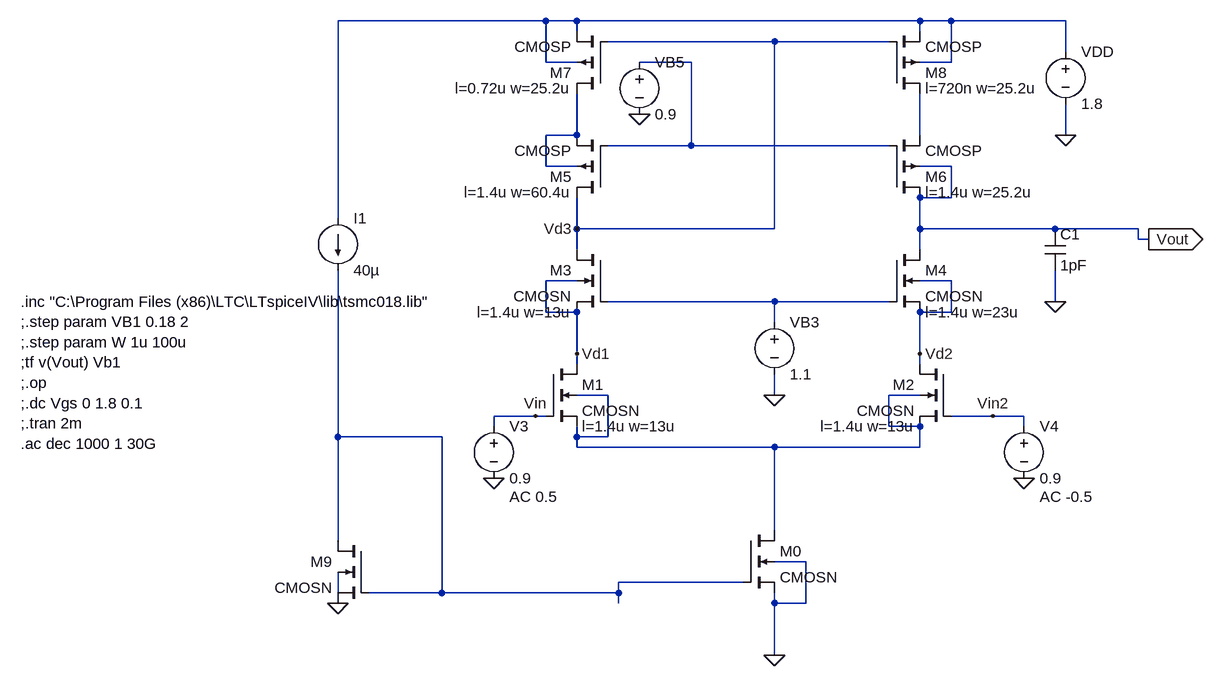
[diagram p0: schematic telescopic2.asc]
telescopic2.asc, the LTspice schematic file:
Version 4
SHEET 1 888 680
WIRE -160 -384 -480 -384
WIRE -112 -384 -160 -384
WIRE 416 -384 -112 -384
WIRE 464 -384 416 -384
WIRE 640 -384 464 -384
WIRE -112 -368 -112 -384
WIRE 416 -368 416 -384
WIRE 192 -352 -64 -352
WIRE 368 -352 192 -352
WIRE 640 -336 640 -384
WIRE -160 -320 -160 -384
WIRE -112 -320 -160 -320
WIRE 64 -320 -16 -320
WIRE 464 -320 464 -384
WIRE 464 -320 416 -320
WIRE -112 -208 -112 -272
WIRE -112 -208 -160 -208
WIRE 416 -208 416 -272
WIRE 640 -208 640 -256
WIRE 64 -192 64 -320
WIRE 64 -192 -64 -192
WIRE 368 -192 64 -192
WIRE -160 -160 -160 -208
WIRE -112 -160 -160 -160
WIRE 464 -160 416 -160
WIRE 464 -112 464 -160
WIRE 464 -112 416 -112
WIRE -480 -80 -480 -384
WIRE -112 -64 -112 -112
WIRE 192 -64 192 -352
WIRE 192 -64 -112 -64
WIRE 416 -64 416 -112
WIRE 624 -64 416 -64
WIRE 752 -64 624 -64
WIRE 752 -48 752 -64
WIRE 768 -48 752 -48
WIRE -112 -32 -112 -64
WIRE 416 -32 416 -64
WIRE -112 16 -160 16
WIRE 464 16 416 16
WIRE 192 48 -64 48
WIRE 368 48 192 48
WIRE 624 48 624 0
WIRE -160 64 -160 16
WIRE -112 64 -160 64
WIRE 464 64 464 16
WIRE 464 64 416 64
WIRE 192 80 192 48
WIRE -112 128 -112 64
WIRE 416 128 416 64
WIRE -112 144 -112 128
WIRE 416 144 416 128
WIRE -64 192 -112 192
WIRE 192 192 192 160
WIRE 416 192 368 192
WIRE -176 224 -240 224
WIRE -160 224 -176 224
WIRE 528 224 464 224
WIRE 576 224 528 224
WIRE -240 240 -240 224
WIRE 368 240 368 192
WIRE 416 240 368 240
WIRE 576 240 576 224
WIRE -480 256 -480 0
WIRE -320 256 -480 256
WIRE -112 256 -112 240
WIRE -64 256 -64 192
WIRE -64 256 -112 256
WIRE -112 272 -112 256
WIRE 192 272 -112 272
WIRE 416 272 416 240
WIRE 416 272 192 272
WIRE 192 400 192 272
WIRE -480 416 -480 256
WIRE 240 448 192 448
WIRE 144 480 -48 480
WIRE -480 496 -480 464
WIRE -320 496 -320 256
WIRE -320 496 -432 496
WIRE -48 496 -48 480
WIRE -48 496 -320 496
WIRE -48 512 -48 496
WIRE 192 512 192 496
WIRE 240 512 240 448
WIRE 240 512 192 512
WIRE 192 592 192 512
FLAG 640 -208 0
FLAG 192 592 0
FLAG 624 48 0
FLAG 192 192 0
FLAG -112 128 Vd1
FLAG 416 128 Vd2
FLAG -112 -64 Vd3
FLAG 528 224 Vin2
FLAG 768 -48 Vout
IOPIN 768 -48 Out
FLAG -16 -240 0
FLAG -240 320 0
FLAG 576 320 0
FLAG -480 512 0
FLAG -176 224 Vin
SYMBOL cmosn -160 144 R0
WINDOW 123 56 96 Left 2
SYMATTR InstName M1
SYMATTR Value2 l=1.4u w=13u
SYMBOL cmosn 368 -32 R0
WINDOW 123 56 96 Left 2
SYMATTR InstName M4
SYMATTR Value2 l=1.4u w=23u
SYMBOL cmosn -64 -32 M0
WINDOW 123 56 96 Left 2
SYMATTR InstName M3
SYMATTR Value2 l=1.4u w=13u
SYMBOL cmosn 464 144 M0
WINDOW 123 56 96 Left 2
SYMATTR InstName M2
SYMATTR Value2 l=1.4u w=13u
SYMBOL cmosn 144 400 R0
SYMATTR InstName M0
SYMATTR Value2 l=180n w=200n
SYMBOL cmosp 368 -112 M180
WINDOW 123 56 8 Left 2
SYMATTR InstName M6
SYMATTR Value2 l=1.4u w=25.2u
SYMBOL cmosp 368 -272 M180
WINDOW 123 56 8 Left 2
SYMATTR InstName M8
SYMATTR Value2 l=720n w=25.2u
SYMBOL cmosp -64 -272 R180
WINDOW 123 56 8 Left 2
SYMATTR InstName M7
SYMATTR Value2 l=0.72u w=25.2u
SYMBOL cmosp -64 -112 R180
WINDOW 123 56 8 Left 2
SYMATTR InstName M5
SYMATTR Value2 l=1.4u w=60.4u
SYMBOL voltage 640 -352 R0
WINDOW 123 0 0 Left 2
WINDOW 39 0 0 Left 2
SYMATTR InstName VDD
SYMATTR Value 1.8
SYMBOL cap 608 -64 R0
SYMATTR InstName C1
SYMATTR Value 1pF
SYMBOL voltage 192 64 R0
WINDOW 123 0 0 Left 2
WINDOW 39 0 0 Left 2
SYMATTR InstName VB3
SYMATTR Value 1.1
SYMBOL voltage -16 -336 R0
SYMATTR InstName VB5
SYMATTR Value 0.9
SYMBOL voltage -240 224 R0
WINDOW 123 24 124 Left 2
WINDOW 39 0 0 Left 2
SYMATTR Value2 AC 0.5
SYMATTR InstName V3
SYMATTR Value 0.9
SYMBOL voltage 576 224 R0
WINDOW 123 24 124 Left 2
WINDOW 39 0 0 Left 2
SYMATTR Value2 AC -0.5
SYMATTR InstName V4
SYMATTR Value 0.9
SYMBOL current -480 -80 R0
SYMATTR InstName I1
SYMATTR Value 40µ
SYMBOL cmosn -432 416 M0
SYMATTR InstName M9
SYMATTR Value2 l=180n w=360n
TEXT -968 48 Left 2 !.inc "C:\\Program Files (x86)\\LTC\\LTspiceIV\\lib\\tsmc018.lib"\n;.step param VB1 0.18 2\n;.step param W 1u 100u\n;tf v(Vout) Vb1\n;.op\n;.dc Vgs 0 1.8 0.1\n;.tran 2m\n.ac dec 1000 1 30G

The netlist it stands for:
* telescopic2.asc
M1 Vd1 Vin N006 N006 CMOSN l=1.4u w=13u
M4 Vout N005 Vd2 Vd2 CMOSN l=1.4u w=23u
M3 Vd3 N005 Vd1 Vd1 CMOSN l=1.4u w=13u
M2 Vd2 Vin2 N006 N006 CMOSN l=1.4u w=13u
M0 N006 N007 0 0 CMOSN l=180n w=200n
M6 Vout N002 N004 Vout CMOSP l=1.4u w=25.2u
M8 N004 Vd3 N001 N001 CMOSP l=720n w=25.2u
M7 N003 Vd3 N001 N001 CMOSP l=0.72u w=25.2u
M5 Vd3 N002 N003 N003 CMOSP l=1.4u w=60.4u
VDD N001 0 1.8
C1 Vout 0 1pF
VB3 N005 0 1.1
VB5 N002 0 0.9
V3 Vin 0 0.9 AC 0.5
V4 Vin2 0 0.9 AC -0.5
I1 N001 N007 40µ
M9 N007 N007 0 N008 CMOSN l=180n w=360n
.model NMOS NMOS
.model PMOS PMOS
.lib standard.mos
.inc "C:\Program Files (x86)\LTC\LTspiceIV\lib\tsmc018.lib"
;.step param VB1 0.18 2
;.step param W 1u 100u
;tf v(Vout) Vb1
;.op
;.dc Vgs 0 1.8 0.1
;.tran 2m
.ac dec 1000 1 30G
.backanno
.end